# Altium schematic sheet msr502.SchDoc
size A4
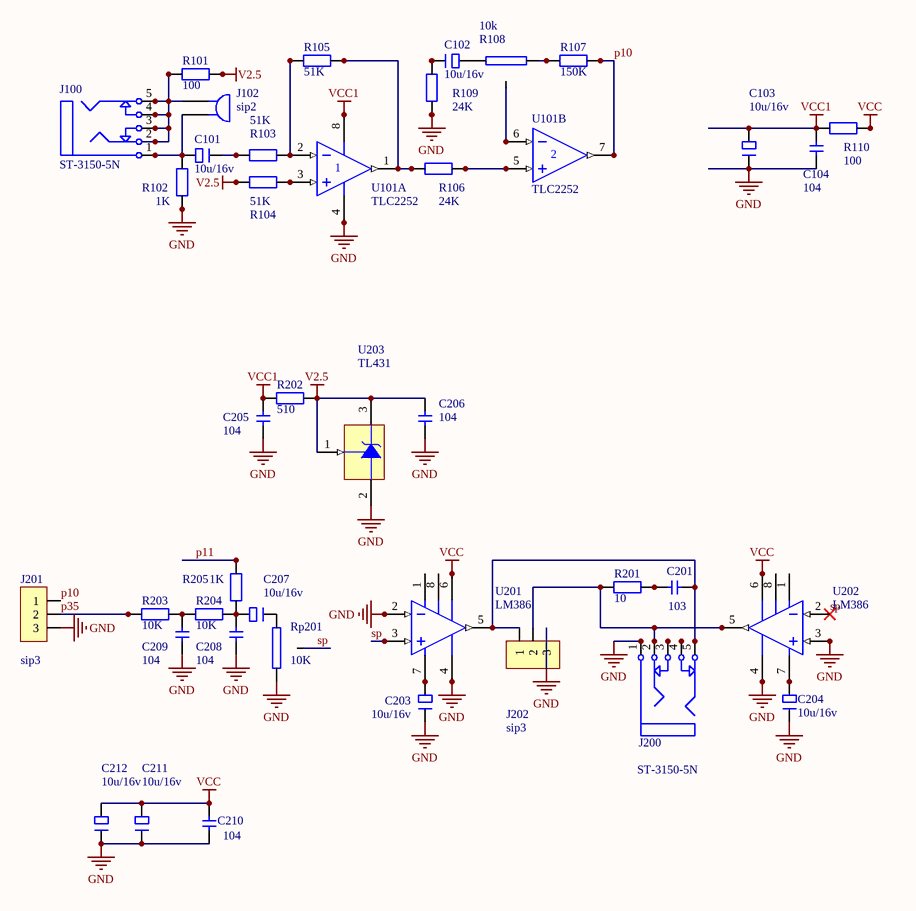
[diagram p0: msr502.SchDoc]

## Parts
C101  10u/16v  [rb.1/.2]
C102  10u/16v  [rb.1/.2]
C103  10u/16v  [rb.1/.2]
C104  104  [CAP010805]
C201  103  [cap0.1]
C203  10u/16v  [rb.1/.2]
C204  10u/16v  [rb.1/.2]
C205  104  [CAP010805]
C206  104  [CAP010805]
C207  10u/16v  [rb.1/.2]
C208  104  [CAP010805]
C209  104  [CAP010805]
C210  104  [CAP010805]
C211  10u/16v  [rb.1/.2]
C212  10u/16v  [rb.1/.2]
J100  value ST-3150-5N  [ST-3150-5N]  (hidden comment: Phonejack Stereo SW)
J102  value sip2  [PIN2]  (hidden comment: pow)
J200  value ST-3150-5N  [ST-3150-5N]  (hidden comment: Phonejack Stereo SW)
J201  value sip3  [SIP3]  (hidden comment: CON3)
J202  value sip3  [SIP3]  (hidden comment: CON3)
R101  value 100  [a038050]  (hidden comment: Res2)
R102  value 1K  [a038050]  (hidden comment: Res2)
R103  value 51K  [a038050]  (hidden comment: Res2)
R104  value 51K  [a038050]  (hidden comment: Res2)
R105  value 51K  [a038050]  (hidden comment: Res2)
R106  value 24K  [a038050]  (hidden comment: Res2)
R107  value 150K  [a038050]  (hidden comment: Res2)
R108  10k  [VR3296-1]
R109  value 24K  [a038050]  (hidden comment: Res2)
R110  value 100  [a038050]  (hidden comment: Res2)
R201  value 10  [a038050]  (hidden comment: Res2)
R202  value 510  [a038050]  (hidden comment: Res2)
R203  value 10K  [a038050]  (hidden comment: Res2)
R204  value 10K  [a038050]  (hidden comment: Res2)
R205  value 1K  [a038050]  (hidden comment: Res2)
Rp201  10k  [VR3296-1]
U101  TLC2252  [DS-8]  (parts A,B of 2)
U201  value LM386  [DS-8]  (hidden comment: LM386ds)
U202  value LM386  [DS-8]  (hidden comment: LM386ds)
U203  value TL431  [29-04]  (hidden comment: TL431AILP)

## Nets
GND: C103.1 C104.2 C203.1 C204.1 C205.2 C206.2 C208.2 C209.2 C210.2 C211.1 C212.1 J200.1 J200.1A J200.1B J201.3 J202.3 R102.2 R102.4 R109.1 R109.3 Rp201.1 U101.4 U101.14 U201.2(IN-) U201.4(GND) U201.12 U201.14 U202.3(IN+) U202.4(GND) U202.13 U202.14 U203.2(A)
V2.5: C206.1 R101.2 R101.4 R104.2 R104.4 R202.2 R202.4 U203.1(REF) U203.3(K)
VCC: C210.1 C211.2 C212.2 R110.2 R110.4 U201.6(VS) U201.16 U202.6(VS) U202.16
VCC1: C103.2 C104.1 C205.1 R110.1 R110.3 R202.1 R202.3 U101.8 U101.18
p10: J201.1 R107.2 R107.4 U101.7(OUT) U101.17
p11: R205.2 R205.4
p35: J201.2 R203.1 R203.3
sp: Rp201.2 U201.3(IN+) U201.13 U202.2(IN-) U202.12
NetC101_1: C101.1 R103.2 R103.4
NetC101_2: C101.2 J100.1 J100.1A J100.1B J102.2 R102.1 R102.3
NetC102_1: C102.1 R109.2 R109.4
NetC102_2: C102.2 R108.1
NetC201_1: C201.1 R201.2 R201.4
NetC201_2: C201.2 J200.5 J200.5A J200.5B J202.1 U201.5(OUT) U201.15
NetC203_2: C203.2 U201.7(BYPASS) U201.17
NetC204_2: C204.2 U202.7(BYPASS) U202.17
NetC207_1: C207.1 Rp201.3
NetC207_2: C207.2 C208.1 R204.2 R204.4 R205.1 R205.3
NetC209_1: C209.1 R203.2 R203.4 R204.1 R204.3
NetJ100_2: J100.2 J100.2A J100.2B J100.3 J100.3A J100.3B J100.4 J100.4A J100.4B J100.5 J100.5A J100.5B J102.1 R101.1 R101.3
NetJ200_2: J200.2 J200.2A J200.2B J202.2 R201.1 R201.3 U202.5(OUT) U202.15
NetJ200_3: J200.3 J200.3A J200.3B
NetJ200_4: J200.4 J200.4A J200.4B
NetR103_1: R103.1 R103.3 R105.1 R105.3 U101.2(IN-) U101.12
NetR104_1: R104.1 R104.3 U101.3(IN+) U101.13
NetR105_2: R105.2 R105.4 R106.1 R106.3 U101.1(OUT) U101.11
NetR106_2: R106.2 R106.4 U101.5(IN+) U101.15
NetR107_1: R107.1 R107.3 R108.3
NetR108_2: R108.2 U101.6(IN-) U101.16
NetU201_1: U201.1(GAIN) U201.11
NetU201_8: U201.8(GAIN) U201.18
NetU202_1: U202.1(GAIN) U202.11
NetU202_8: U202.8(GAIN) U202.18

## Library data of the parts
C101-C103 C203 C204 C207 C211 C212 = ELECTRO1: Electrolytic Capacitor; Value: 10u/16v
C104 C201 C205 C206 C208-C210 = CAP: Capacitor
  C104 C210: Value: 104
  C201: value: 103
  C205 C206 C208 C209: value: 104
J100 J200 = Phonejack Stereo SW: 3-Conductor Jack with 2 break contacts (normals) and 2 auxiliary make contacts; Published: 5-Jan-2004; LatestRevisionDate: 17-Dec-2003; LatestRevisionNote: PCB Footprint replaced.; DatasheetDocument: 07-Mar-2000; Publisher: Altium Limited; ComponentLink1Description: Manufacturer Link; ComponentLink1URL: http://domino.kycon.com/internet/Products.html
J102 = Mic1: Microphone; Published: 24-Mar-1999; LatestRevisionDate: 17-Jul-2002; LatestRevisionNote: Re-released for DXP Platform.; PackageReference: PIN2; Publisher: Altium Limited
J201 J202 = CON3: Connector
R101-R107 R109 R110 R201-R205 = Res22: Resistor; Published: 8-Jun-2000; LatestRevisionDate: 17-Jul-2002; LatestRevisionNote: Re-released for DXP Platform.; PackageReference: AXIAL-0.4; Publisher: Altium Limited
R108 Rp201 = RES3: 3296
  R108: value: 10k
  Rp201: value: 10K
U101 = LM358ds: Dual Low-Power Operational Amplifier; Published: 17-Jul-2002; LatestRevisionDate: 06-Jun-2005; LatestRevisionNote: Stylized 3D Model Added.; DatasheetVersion: 1988; PackageReference: 626-05; Publisher: Altium Limited; PackageDescription: DIP; 8 Leads; Row Spacing 7.62 mm; Pitch 2.54 mm; ComponentLink1Description: Manufacturer Link; ComponentLink1URL: http://www.onsemi.com/site/products/parametrics/0,4446,251,00.html; ComponentLink2Description: Datasheet; ComponentLink2URL: http://www.onsemi.com/pub/Collateral/LM358-D.PDF; value: TLC2252
U201 U202 = LM386ds: Low Voltage Audio Power Amplifier; PartNumber: LM386N-1; Manufacturer: National Semiconductor; CompType: Audio IC; PackageTopMarking: NSUZXYTT*LM*386N-1; Published: 4-Dec-2008; DatasheetVersion: Aug-2000; PackageVersion: revG, May-2006; PackageReference: N08E; PackageDescription: MDIP, .365 x .250 x .130in, 8 Lead, .100in Pitch; RoHS: O; PinCount: 8; DigiKeyPartNumber: LM386N-1-ND; Code_JEDEC: MS-001-BA; ComponentLink1Description: LM386 Datasheet; ComponentLink1URL: http://www.national.com/ds/LM/LM386.pdf; ComponentLink2Description: LM386 Web Page; ComponentLink2URL: http://www.national.com/pf/LM/LM386.html; ComponentLink3Description: N08E Package Page; ComponentLink3URL: http://www.national.com/packaging/folders/n08e.html
U203 = TL431AILP: Programmable Precision Reference; Published: 15-Apr-2002; DatasheetVersion: 1999; PackageVersion: 1996; PackageReference: 29-04; Publisher: Altium Limited; PackageDescription: TO, Flat Index; 3 In-Line, Axial Leads; Body Dia. 4.8mm; Leads 0.48 x 0.51 mm (max); ComponentLink1Description: Manufacturer Link; ComponentLink1URL: http://www.onsemi.com/site/products/taxonomy/0,4438,503,00.html; ComponentLink2Description: Datasheet; ComponentLink2URL: http://www.onsemi.com/pub/Collateral/TL431-D.PDF